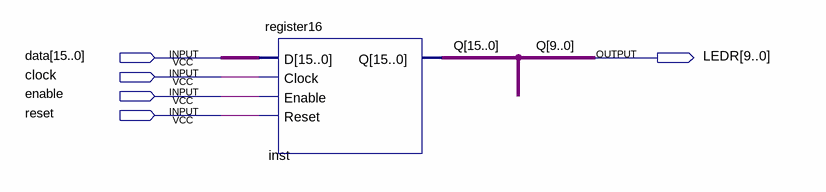
[diagram p0: schematic sheet]
// Quartus schematic led_control.bdf as structural Verilog: 1 symbols, 5 pins
module led_control (
  input  [15:0] data,
  input  clock,
  input  enable,
  input  reset,
  output [9:0] LEDR
);

  wire [15:10] Q;

  register16 inst (.D(data), .Clock(clock), .Enable(enable), .Reset(reset), .Q({Q, LEDR}));

  // Other names for the same wires on the sheet: Q[9:0] = LEDR
endmodule
